# Altium schematic sheet mixer.SchDoc
size A4
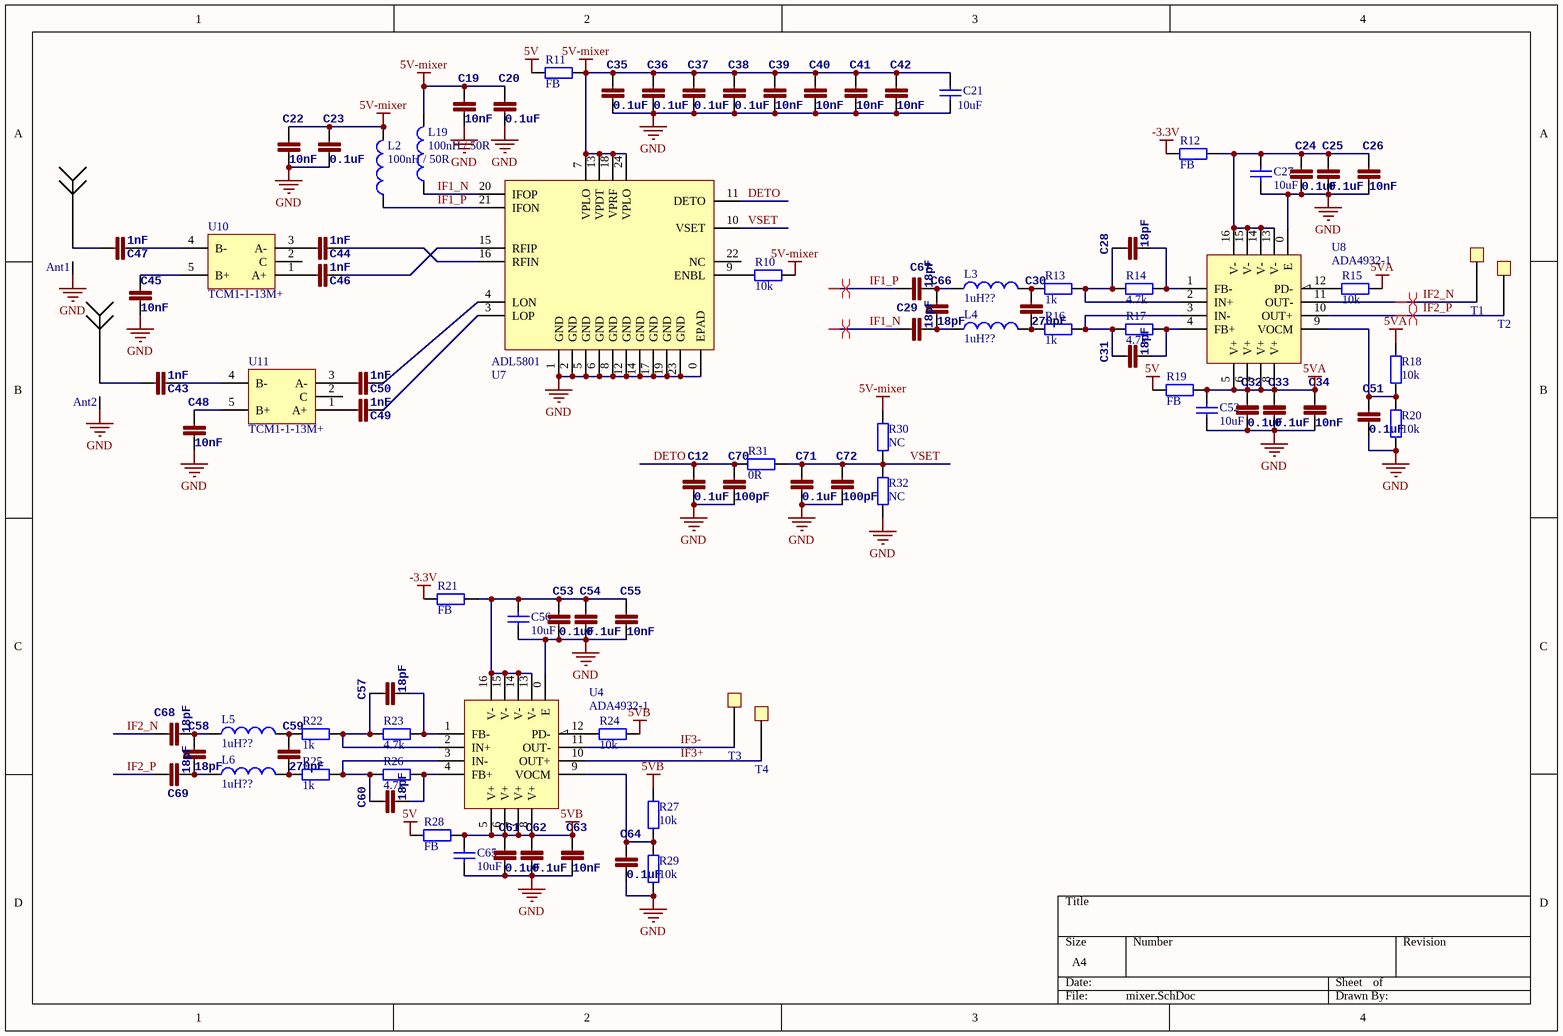
[diagram p0: mixer.SchDoc]

## Parts
Ant1  Antenna  [SMA-2]  (value not drawn)
Ant2  Antenna  [SMA-2]  (value not drawn)
C12  0.1uF  [0402]
C19  10nF  [0402]
C20  0.1uF  [0402]
C21  10uF  [0805]
C22  10nF  [0402]
C23  0.1uF  [0402]
C24  0.1uF  [0402]
C25  0.1uF  [0402]
C26  10nF  [0402]
C27  10uF  [0805]
C28  18pF  [0402]
C29  18pF  [0402]
C30  270pF  [0402]
C31  18pF  [0402]
C32  0.1uF  [0402]
C33  0.1uF  [0402]
C34  10nF  [0402]
C35  0.1uF  [0402]
C36  0.1uF  [0402]
C37  0.1uF  [0402]
C38  0.1uF  [0402]
C39  10nF  [0402]
C40  10nF  [0402]
C41  10nF  [0402]
C42  10nF  [0402]
C43  1nF  [0402]
C44  1nF  [0402]
C45  10nF  [0402]
C46  1nF  [0402]
C47  1nF  [0402]
C48  10nF  [0402]
C49  1nF  [0402]
C50  1nF  [0402]
C51  0.1uF  [0402]
C52  10uF  [0805]
C53  0.1uF  [0402]
C54  0.1uF  [0402]
C55  10nF  [0402]
C56  10uF  [0805]
C57  18pF  [0402]
C58  18pF  [0402]
C59  270pF  [0402]
C60  18pF  [0402]
C61  0.1uF  [0402]
C62  0.1uF  [0402]
C63  10nF  [0402]
C64  0.1uF  [0402]
C65  10uF  [0805]
C66  18pF  [0402]
C67  18pF  [0402]
C68  18pF  [0402]
C69  18pF  [0402]
C70  100pF  [0402]
C71  0.1uF  [0402]
C72  100pF  [0402]
L2  value 100nH / 50R  [0603]  (hidden comment: Inductor)
L3  value 1uH??  [0805]  (hidden comment: Inductor)
L4  value 1uH??  [0805]  (hidden comment: Inductor)
L5  value 1uH??  [0805]  (hidden comment: Inductor)
L6  value 1uH??  [0805]  (hidden comment: Inductor)
L19  value 100nH / 50R  [0603]  (hidden comment: Inductor)
R10  value 10k  [0402]  (hidden comment: Res2)
R11  FB  [0603]
R12  FB  [0603]
R13  value 1k  [0402]  (hidden comment: Res2)
R14  value 4.7k  [0402]  (hidden comment: Res2)
R15  value 10k  [0402]  (hidden comment: Res2)
R16  value 1k  [0402]  (hidden comment: Res2)
R17  value 4.7k  [0402]  (hidden comment: Res2)
R18  value 10k  [0402]  (hidden comment: Res2)
R19  FB  [0603]
R20  value 10k  [0402]  (hidden comment: Res2)
R21  FB  [0603]
R22  value 1k  [0402]  (hidden comment: Res2)
R23  value 4.7k  [0402]  (hidden comment: Res2)
R24  value 10k  [0402]  (hidden comment: Res2)
R25  value 1k  [0402]  (hidden comment: Res2)
R26  value 4.7k  [0402]  (hidden comment: Res2)
R27  value 10k  [0402]  (hidden comment: Res2)
R28  FB  [0603]
R29  value 10k  [0402]  (hidden comment: Res2)
R30  value NC  [0402]  (hidden comment: Res2)
R31  value 0R  [0402]  (hidden comment: Res2)
R32  value NC  [0402]  (hidden comment: Res2)
T1  TestPad  [TestPad - 1mm]  (value not drawn)
T2  TestPad  [TestPad - 1mm]  (value not drawn)
T3  TestPad  [TestPad - 1mm]  (value not drawn)
T4  TestPad  [TestPad - 1mm]  (value not drawn)
U4  ADA4932-1  [ADA4932-1]
U7  ADL5801  [ADL5801]
U8  ADA4932-1  [ADA4932-1]
U10  TCM1-1-13M+  [TCM-63AX+]
U11  TCM1-1-13M+  [TCM-63AX+]

## Nets
5V: R11.1 R19.1 R28.1
5V-mixer: C19.2 C20.2 C21.2 C22.2 C23.2 C35.2 C36.2 C37.2 C38.2 C39.2 C40.2 C41.2 C42.2 L2.2 L19.2 R10.2 R11.2 R30.2 U7.7(VPLO) U7.13(VPDT) U7.18(VPRF) U7.24(VPLO)
5VA: C32.2 C33.2 C34.2 C52.1 R15.2 R18.2 R19.2 U8.5(V+) U8.6(V+) U8.7(V+) U8.8(V+)
5VB: C61.2 C62.2 C63.2 C65.1 R24.2 R27.2 R28.2 U4.5(V+) U4.6(V+) U4.7(V+) U4.8(V+)
-3.3V: R12.1 R21.1
GND: Ant1.GND(G) Ant2.GND(G) C12.1 C19.1 C20.1 C21.1 C22.1 C23.1 C24.1 C25.1 C26.1 C27.2 C32.1 C33.1 C34.1 C35.1 C36.1 C37.1 C38.1 C39.1 C40.1 C41.1 C42.1 C45.1 C48.1 C51.1 C52.2 C53.1 C54.1 C55.1 C56.2 C61.1 C62.1 C63.1 C64.1 C65.2 C70.1 C71.1 C72.1 R20.1 R29.1 R32.1 U4.0(E) U7.0(EPAD) U7.1(GND) U7.2(GND) U7.5(GND) U7.6(GND) U7.8(GND) U7.12(GND) U7.14(GND) U7.17(GND) U7.19(GND) U7.23(GND) U8.0(E)
DETO: C12.2 C70.2 R31.1 U7.11(DETO)
IF1_N: C29.2 L19.1 U7.20(IFOP)
IF1_P: C67.2 L2.1 U7.21(IFON)
IF2_N: C68.2 T1.1 U8.11(OUT-)
IF2_P: C69.2 T2.1 U8.10(OUT+)
IF3+: T4.1 U4.10(OUT+)
IF3-: T3.1 U4.11(OUT-)
VSET: C71.2 C72.2 R30.1 R31.2 R32.2 U7.10(VSET)
NetAnt1_1: Ant1.1 C47.1
NetAnt2_1: Ant2.1 C43.1
NetC24_2: C24.2 C25.2 C26.2 C27.1 R12.2 U8.13(V-) U8.14(V-) U8.15(V-) U8.16(V-)
NetC28_1: C28.1 R14.2 U8.1(FB-)
NetC28_2: C28.2 R13.2 R14.1 U8.2(IN+)
NetC29_1: C29.1 C66.1 L4.1
NetC30_1: C30.1 L4.2 R16.1
NetC30_2: C30.2 L3.2 R13.1
NetC31_1: C31.1 R17.2 U8.4(FB+)
NetC31_2: C31.2 R16.2 R17.1 U8.3(IN-)
NetC43_2: C43.2 U11.4(B-)
NetC44_1: C44.1 U10.3(A-)
NetC44_2: C44.2 U7.16(RFIN)
NetC45_2: C45.2 U10.5(B+)
NetC46_1: C46.1 U10.1(A+)
NetC46_2: C46.2 U7.15(RFIP)
NetC47_2: C47.2 U10.4(B-)
NetC48_2: C48.2 U11.5(B+)
NetC49_1: C49.1 U11.1(A+)
NetC49_2: C49.2 U7.3(LOP)
NetC50_1: C50.1 U11.3(A-)
NetC50_2: C50.2 U7.4(LON)
NetC51_2: C51.2 R18.1 R20.2 U8.9(VOCM)
NetC53_2: C53.2 C54.2 C55.2 C56.1 R21.2 U4.13(V-) U4.14(V-) U4.15(V-) U4.16(V-)
NetC57_1: C57.1 R23.2 U4.1(FB-)
NetC57_2: C57.2 R22.2 R23.1 U4.2(IN+)
NetC58_1: C58.1 C69.1 L6.1
NetC58_2: C58.2 C68.1 L5.1
NetC59_1: C59.1 L6.2 R25.1
NetC59_2: C59.2 L5.2 R22.1
NetC60_1: C60.1 R26.2 U4.4(FB+)
NetC60_2: C60.2 R25.2 R26.1 U4.3(IN-)
NetC64_2: C64.2 R27.1 R29.2 U4.9(VOCM)
NetC66_2: C66.2 C67.1 L3.1
NetR10_1: R10.1 U7.9(ENBL)
NetR15_1: R15.1 U8.12(PD-)
NetR24_1: R24.1 U4.12(PD-)

Not connected (* = marked no-connect by the designer): U7 22(NC); U10 2(C); U11 2(C)

## Layout directives
differential pair: IF1_N, IF1_P, IF2_N, IF2_P

## Library data of the parts
C12 C19 C20 C22-C26 C28-C51 C53-C55 C57-C64 C66-C72 = CAP0402-CAP: <b>Capacitor</b> / Standard 0603 ceramic capacitor, and 0.1" leaded capacitor.; PARTNO: CC0402ZRY5V7BB104
C21 C27 C52 C56 C65 = Cap: Capacitor; Published: 8-Jun-2000; LatestRevisionDate: 17-Jul-2002; LatestRevisionNote: Re-released for DXP Platform.; PackageReference: RAD-0.3; Publisher: Altium Limited; PackageDescription: Radial Cap, Thru-Hole; 2 Leads; 0.3 in Pin Spacing
L2-L6 L19 = Inductor: Code_IEC: 1005; Published: 8-Jun-2000; LatestRevisionDate: 29-May-2009; LatestRevisionNote: IPC-7351 Footprint Added.; PackageReference: 0402-A; Publisher: Altium Limited; PackageDescription: Chip Inductor; Code_JEITA: 0402
R10 R13-R18 R20 R22-R27 R29-R32 = Res2: Resistor; Published: 8-Jun-2000; LatestRevisionDate: 17-Jul-2002; LatestRevisionNote: Re-released for DXP Platform.; PackageReference: AXIAL-0.4; Publisher: Altium Limited; PackageDescription: Axial Device, Thru-Hole; 2 Leads; 0.4 in Pin Spacing
R11 R12 R19 R21 R28 = Res2: Resistor; Value: 0Ohm; Published: 8-Jun-2000; LatestRevisionDate: 17-Jul-2002; LatestRevisionNote: Re-released for DXP Platform.; PackageReference: AXIAL-0.4; Publisher: Altium Limited; PackageDescription: Axial Device, Thru-Hole; 2 Leads; 0.4 in Pin Spacing
U10 U11 = TCM-63AX+